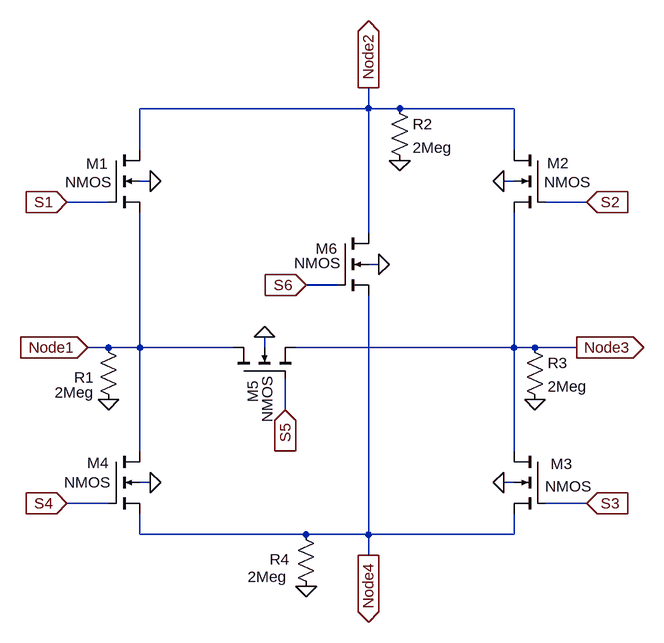
[diagram p0: schematic Switch_matrix.asc]
Switch_matrix.asc, the LTspice schematic file:
Version 4
SHEET 1 1160 836
WIRE 304 16 304 -16
WIRE 304 16 -48 16
WIRE 352 16 304 16
WIRE 528 16 352 16
WIRE -48 80 -48 16
WIRE 528 80 528 16
WIRE -32 128 -48 128
WIRE 528 128 512 128
WIRE -96 160 -160 160
WIRE 640 160 576 160
WIRE 304 208 304 16
WIRE 320 256 304 256
WIRE 256 288 208 288
WIRE -96 384 -128 384
WIRE -48 384 -48 176
WIRE -48 384 -96 384
WIRE 96 384 -48 384
WIRE 144 384 144 368
WIRE 528 384 528 176
WIRE 528 384 192 384
WIRE 560 384 528 384
WIRE 624 384 560 384
WIRE 176 480 176 432
WIRE -48 544 -48 384
WIRE 528 544 528 384
WIRE -32 592 -48 592
WIRE 528 592 512 592
WIRE -96 624 -160 624
WIRE 640 624 576 624
WIRE -48 672 -48 640
WIRE 208 672 -48 672
WIRE 304 672 304 304
WIRE 304 672 208 672
WIRE 528 672 528 640
WIRE 528 672 304 672
WIRE 304 704 304 672
FLAG -160 160 S1
IOPIN -160 160 In
FLAG 640 160 S2
IOPIN 640 160 In
FLAG 640 624 S3
IOPIN 640 624 In
FLAG -160 624 S4
IOPIN -160 624 In
FLAG 176 480 S5
IOPIN 176 480 In
FLAG 208 288 S6
IOPIN 208 288 In
FLAG -32 128 0
FLAG -32 592 0
FLAG 512 128 0
FLAG 512 592 0
FLAG 320 256 0
FLAG 144 368 0
FLAG -128 384 Node1
IOPIN -128 384 In
FLAG 304 704 Node4
IOPIN 304 704 Out
FLAG 624 384 Node3
IOPIN 624 384 Out
FLAG 304 -16 Node2
IOPIN 304 -16 Out
FLAG 352 96 0
FLAG 560 464 0
FLAG 208 752 0
FLAG -96 464 0
SYMBOL nmos4 -96 80 R0
WINDOW 0 -34 21 Left 2
WINDOW 3 -67 49 Left 2
SYMATTR InstName M1
SYMBOL nmos4 576 80 M0
WINDOW 0 -37 20 Left 2
WINDOW 3 -70 49 Left 2
SYMATTR InstName M2
SYMBOL nmos4 576 544 M0
WINDOW 0 -42 19 Left 2
WINDOW 3 -72 54 Left 2
SYMATTR InstName M3
SYMBOL nmos4 -96 544 R0
WINDOW 0 -33 18 Left 2
WINDOW 3 -68 48 Left 2
SYMATTR InstName M4
SYMBOL nmos4 96 432 R270
WINDOW 0 -37 30 Left 2
WINDOW 3 -68 52 Left 2
SYMATTR InstName M5
SYMBOL nmos4 256 208 R0
WINDOW 0 -33 24 Left 2
WINDOW 3 -66 46 Left 2
SYMATTR InstName M6
SYMBOL res -112 368 R0
WINDOW 0 -37 62 Left 2
WINDOW 3 -67 85 Left 2
SYMATTR InstName R1
SYMATTR Value 2Meg
SYMBOL res 336 0 R0
SYMATTR InstName R2
SYMATTR Value 2Meg
SYMBOL res 544 368 R0
SYMATTR InstName R3
SYMATTR Value 2Meg
SYMBOL res 192 656 R0
WINDOW 0 -40 54 Left 2
WINDOW 3 -74 81 Left 2
SYMATTR InstName R4
SYMATTR Value 2Meg

The netlist it stands for:
* Switch_matrix.asc
M1 Node2 S1 Node1 0 NMOS
M2 Node2 S2 Node3 0 NMOS
M3 Node3 S3 Node4 0 NMOS
M4 Node1 S4 Node4 0 NMOS
M5 Node1 S5 Node3 0 NMOS
M6 Node2 S6 Node4 0 NMOS
R1 Node1 0 2Meg
R2 Node2 0 2Meg
R3 Node3 0 2Meg
R4 Node4 0 2Meg
.model NMOS NMOS
.model PMOS PMOS
.lib standard.mos
.backanno
.end